# Altium schematic sheet Mother Board.SchDoc
size A
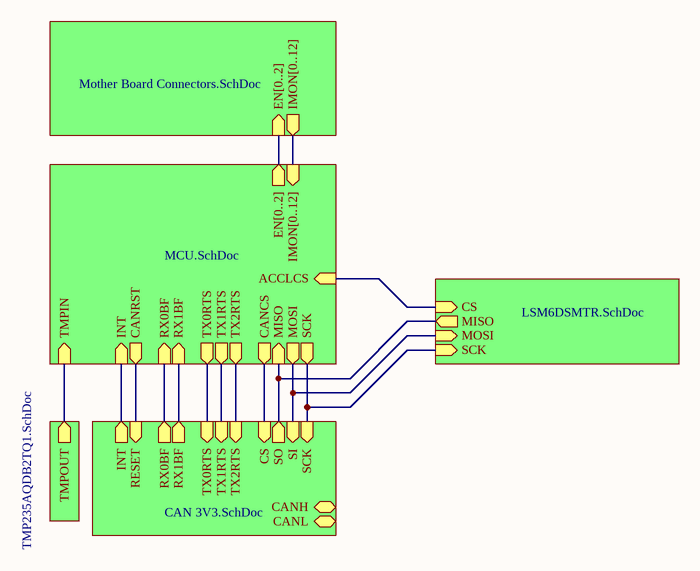
[diagram p0: Mother Board.SchDoc]

## Sub-sheets
Designator = Mother Board Connectors.SchDoc: EN[0..2] (in), IMON[0..12] (out)
Designator = CAN 3V3.SchDoc: SI (in), SO (out), CANH (bidir), TX1RTS (in), RX0BF (out), INT (out), TX2RTS (in), CS (in), SCK (in), RESET (in), TX0RTS (in), CANL (bidir), RX1BF (out)
Designator = TMP235AQDB2TQ1.SchDoc: TMPOUT (out)
Designator = MCU.SchDoc: EN[0..2] (out), IMON[0..12] (in), MISO (in), INT (in), RX0BF (in), RX1BF (in), MOSI (out), TX2RTS (out), TX1RTS (out), TX0RTS (out), TMPIN (in), CANCS (out), SCK (out), CANRST (out), ACCLCS (in)
Designator = LSM6DSMTR.SchDoc: CS (in), MOSI (in), MISO (out), SCK (in)

## Nets
(unnamed): sheet Designator/SI, sheet Designator/MOSI, sheet Designator/MOSI
(unnamed): sheet Designator/SO, sheet Designator/MISO, sheet Designator/MISO
(unnamed): sheet Designator/TX1RTS, sheet Designator/TX1RTS
(unnamed): sheet Designator/RX0BF, sheet Designator/RX0BF
(unnamed): sheet Designator/INT, sheet Designator/INT
(unnamed): sheet Designator/TX2RTS, sheet Designator/TX2RTS
(unnamed): sheet Designator/CS, sheet Designator/CANCS
(unnamed): sheet Designator/SCK, sheet Designator/SCK, sheet Designator/SCK
(unnamed): sheet Designator/RESET, sheet Designator/CANRST
(unnamed): sheet Designator/TX0RTS, sheet Designator/TX0RTS
(unnamed): sheet Designator/RX1BF, sheet Designator/RX1BF
(unnamed): sheet Designator/TMPOUT, sheet Designator/TMPIN
(unnamed): sheet Designator/ACCLCS, sheet Designator/CS